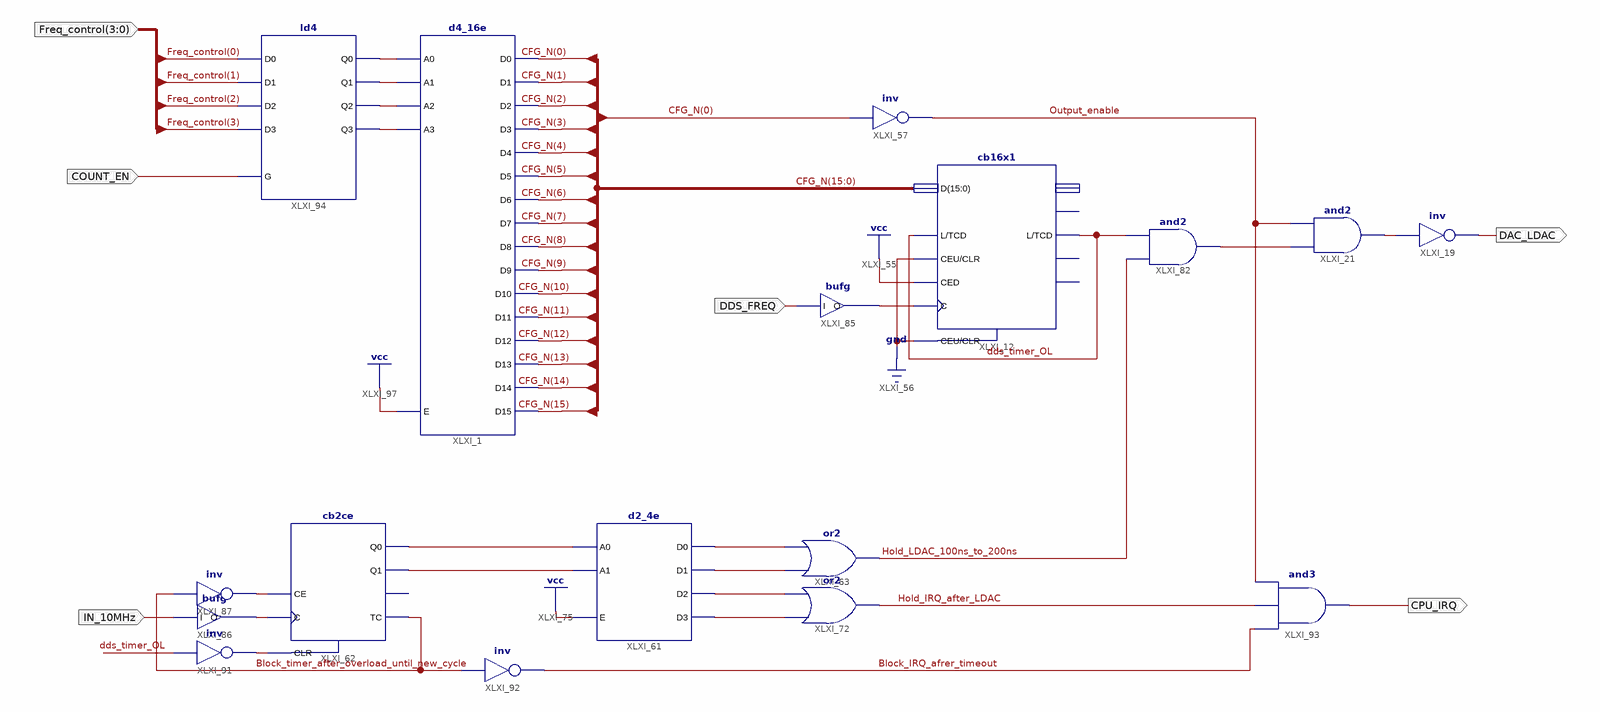
[diagram p0: schematic sheet 1]
// Xilinx ISE schematic sch.sch (xc9500xl) as structural Verilog: 17 symbols, 6 ports
module sch (
  input  DDS_FREQ,
  input  [3:0] Freq_control,
  input  COUNT_EN,
  input  IN_10MHz,
  output DAC_LDAC,
  output CPU_IRQ
);

  wire Block_IRQ_afrer_timeout, Block_timer_after_overload_until_new_cycle, dds_timer_OL, Delay_0_to_100ns,
       Delay_plus_100ns, Hold_IRQ_after_LDAC, Hold_LDAC_100ns_to_200ns, Output_enable, XLXN_110, XLXN_111,
       XLXN_175, XLXN_176, XLXN_203, XLXN_204, XLXN_226, XLXN_228, XLXN_239, XLXN_243, XLXN_245, XLXN_246,
       XLXN_247, XLXN_248;
  wire [15:0] CFG_N;

  cb16x1 XLXI_12 (
    .C(XLXN_226), .CED(1'b1), .CEU(1'b0), .CLR(1'b0), .D(CFG_N), .L(dds_timer_OL), .TCD(dds_timer_OL));  // open: CEOD, CEOU, Q, TCU
  not XLXI_57 (Output_enable, CFG_N[0]);
  not XLXI_19 (DAC_LDAC, XLXN_110);
  and XLXI_21 (XLXN_110, XLXN_111, Output_enable);
  and XLXI_82 (XLXN_111, Hold_LDAC_100ns_to_200ns, dds_timer_OL);
  bufg XLXI_85 (.I(DDS_FREQ), .O(XLXN_226));
  ld4 XLXI_94 (
    .D0(Freq_control[0]), .D1(Freq_control[1]), .D2(Freq_control[2]), .D3(Freq_control[3]), .G(COUNT_EN),
    .Q0(XLXN_245), .Q1(XLXN_246), .Q2(XLXN_247), .Q3(XLXN_248));
  d4_16e XLXI_1 (
    .A0(XLXN_245), .A1(XLXN_246), .A2(XLXN_247), .A3(XLXN_248), .E(1'b1), .D0(CFG_N[0]), .D1(CFG_N[1]),
    .D10(CFG_N[10]), .D11(CFG_N[11]), .D12(CFG_N[12]), .D13(CFG_N[13]), .D14(CFG_N[14]), .D15(CFG_N[15]),
    .D2(CFG_N[2]), .D3(CFG_N[3]), .D4(CFG_N[4]), .D5(CFG_N[5]), .D6(CFG_N[6]), .D7(CFG_N[7]), .D8(CFG_N[8]),
    .D9(CFG_N[9]));
  cb2ce XLXI_62 (
    .C(XLXN_228), .CE(XLXN_239), .CLR(XLXN_243), .Q0(XLXN_175), .Q1(XLXN_176),
    .TC(Block_timer_after_overload_until_new_cycle));  // open: CEO
  d2_4e XLXI_61 (
    .A0(XLXN_175), .A1(XLXN_176), .E(1'b1), .D0(Delay_0_to_100ns), .D1(Delay_plus_100ns), .D2(XLXN_203),
    .D3(XLXN_204));
  or XLXI_63 (Hold_LDAC_100ns_to_200ns, Delay_plus_100ns, Delay_0_to_100ns);
  or XLXI_72 (Hold_IRQ_after_LDAC, XLXN_204, XLXN_203);
  bufg XLXI_86 (.I(IN_10MHz), .O(XLXN_228));
  not XLXI_87 (XLXN_239, Block_timer_after_overload_until_new_cycle);
  not XLXI_91 (XLXN_243, dds_timer_OL);
  not XLXI_92 (Block_IRQ_afrer_timeout, Block_timer_after_overload_until_new_cycle);
  and XLXI_93 (CPU_IRQ, Block_IRQ_afrer_timeout, Hold_IRQ_after_LDAC, Output_enable);
endmodule
